# Altium schematic sheet 0226_GPU_ GPIO 2 OF 2.SchDoc
size 848 x 558 mm
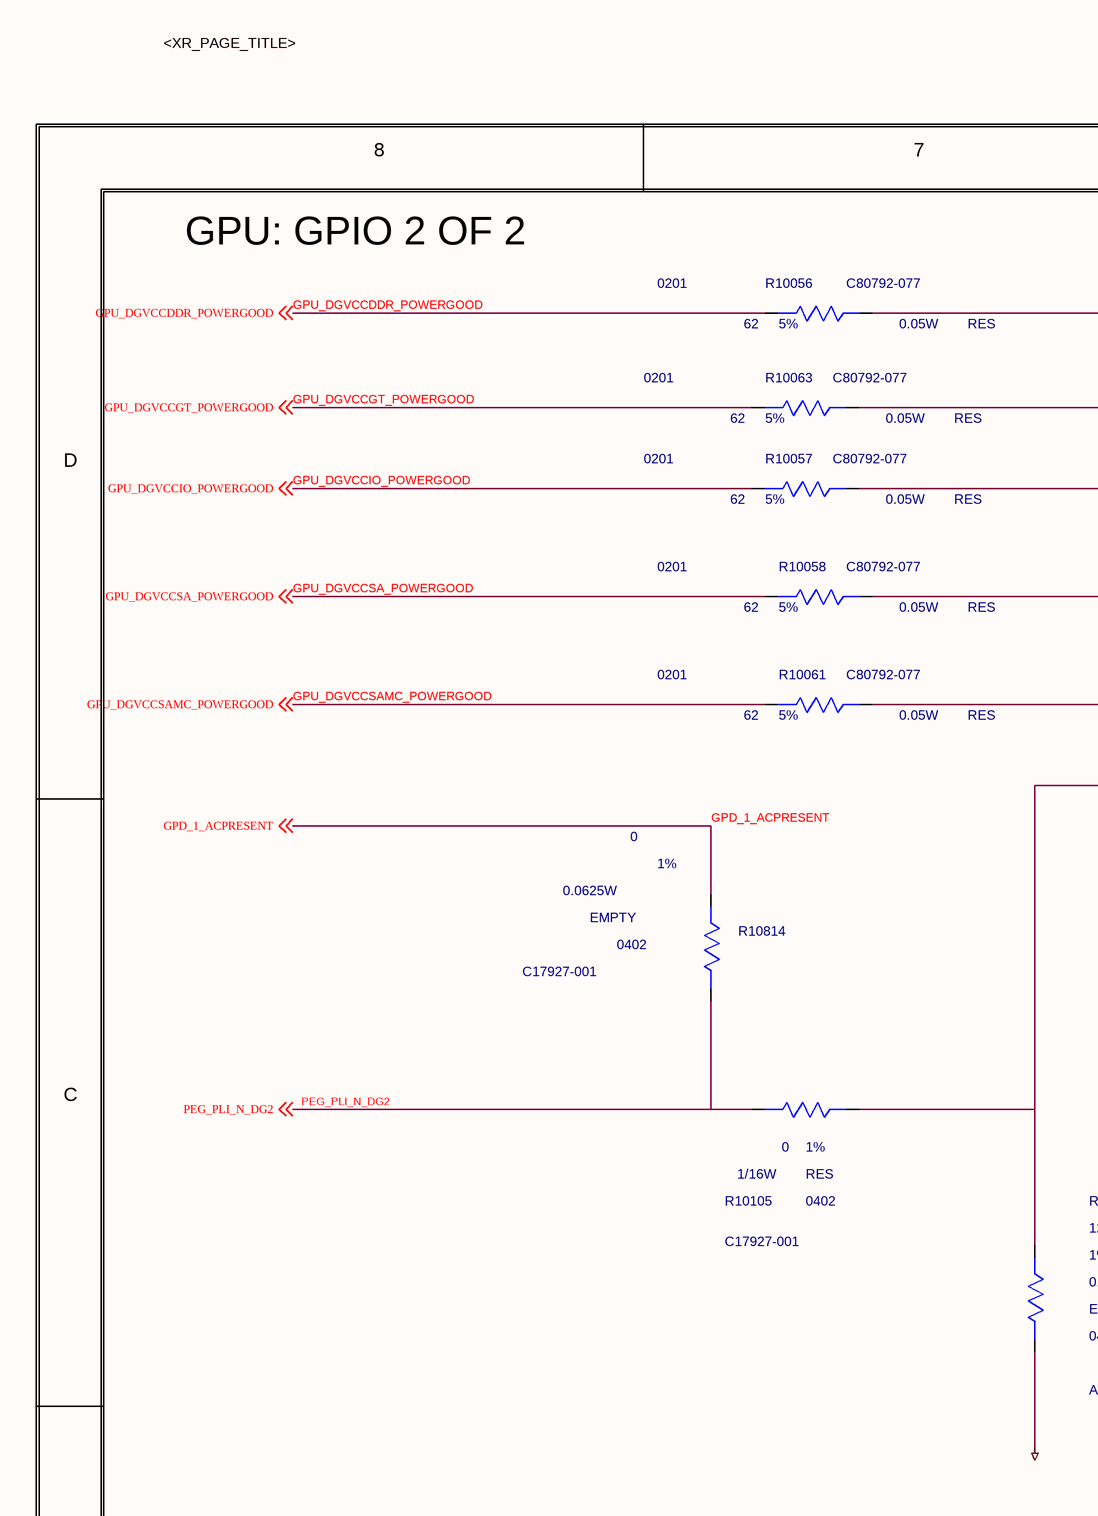
[diagram p0: 0226_GPU_ GPIO 2 OF 2.SchDoc, top left]
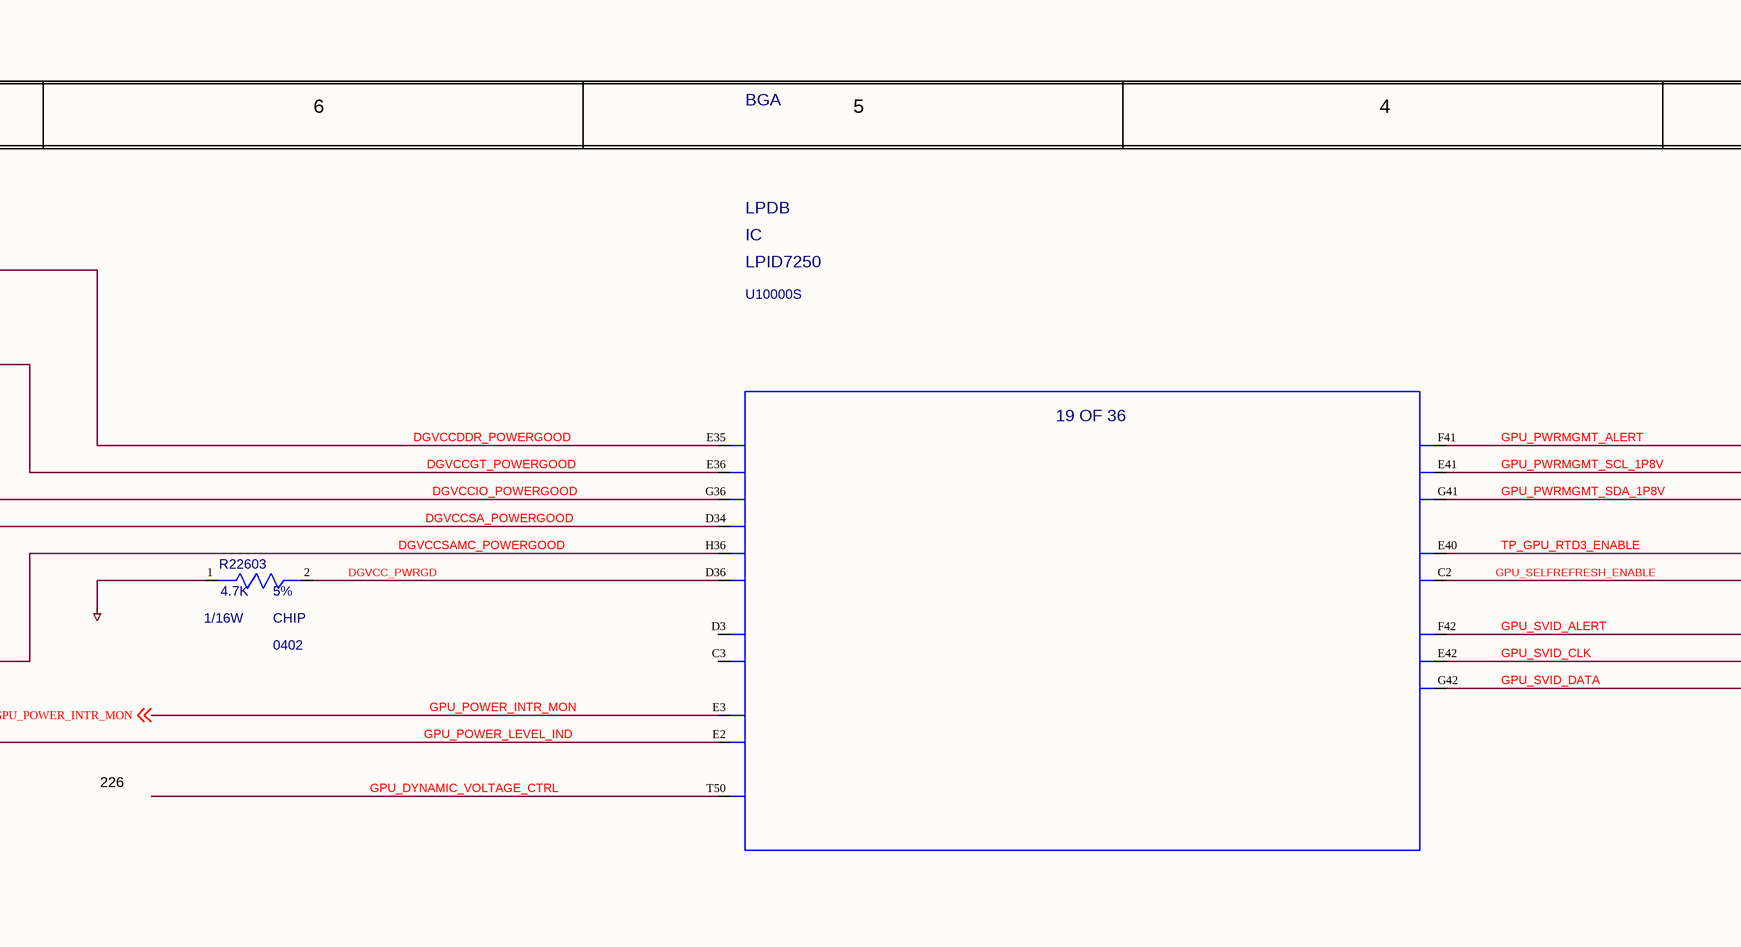
[diagram p1: 0226_GPU_ GPIO 2 OF 2.SchDoc, top middle]
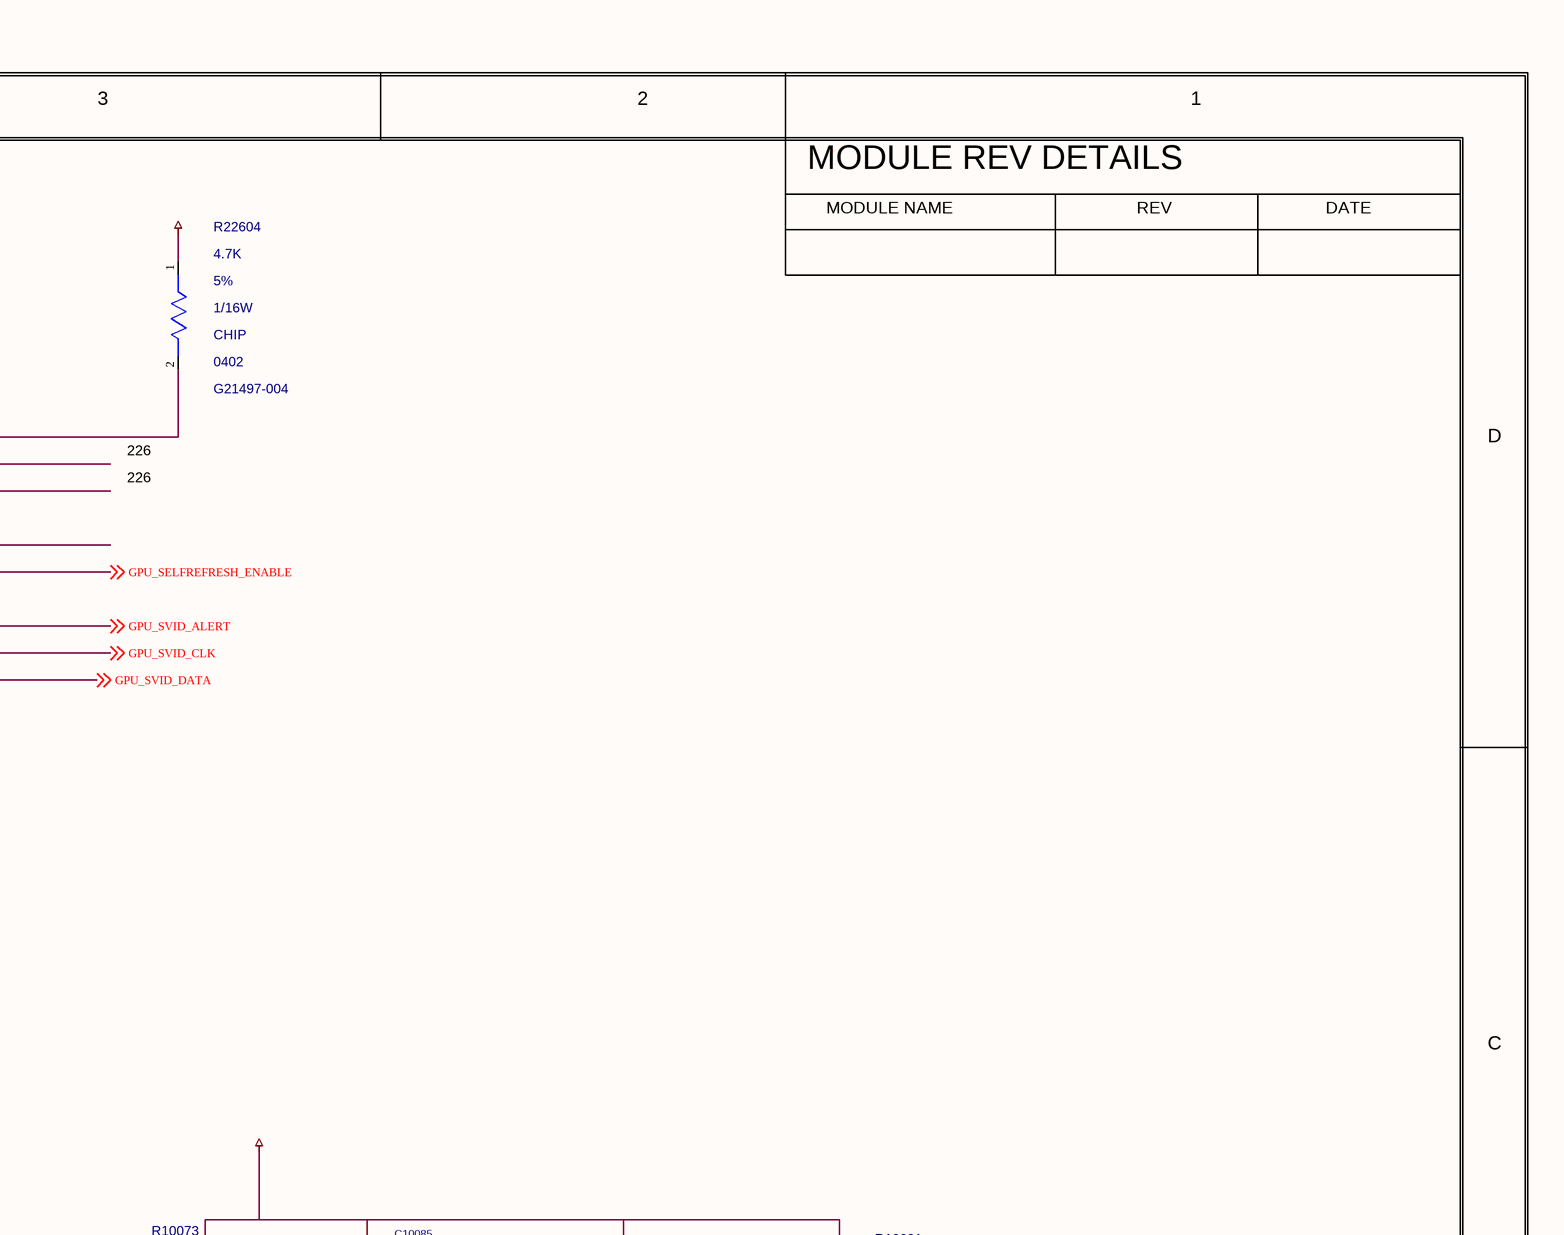
[diagram p2: 0226_GPU_ GPIO 2 OF 2.SchDoc, top right]
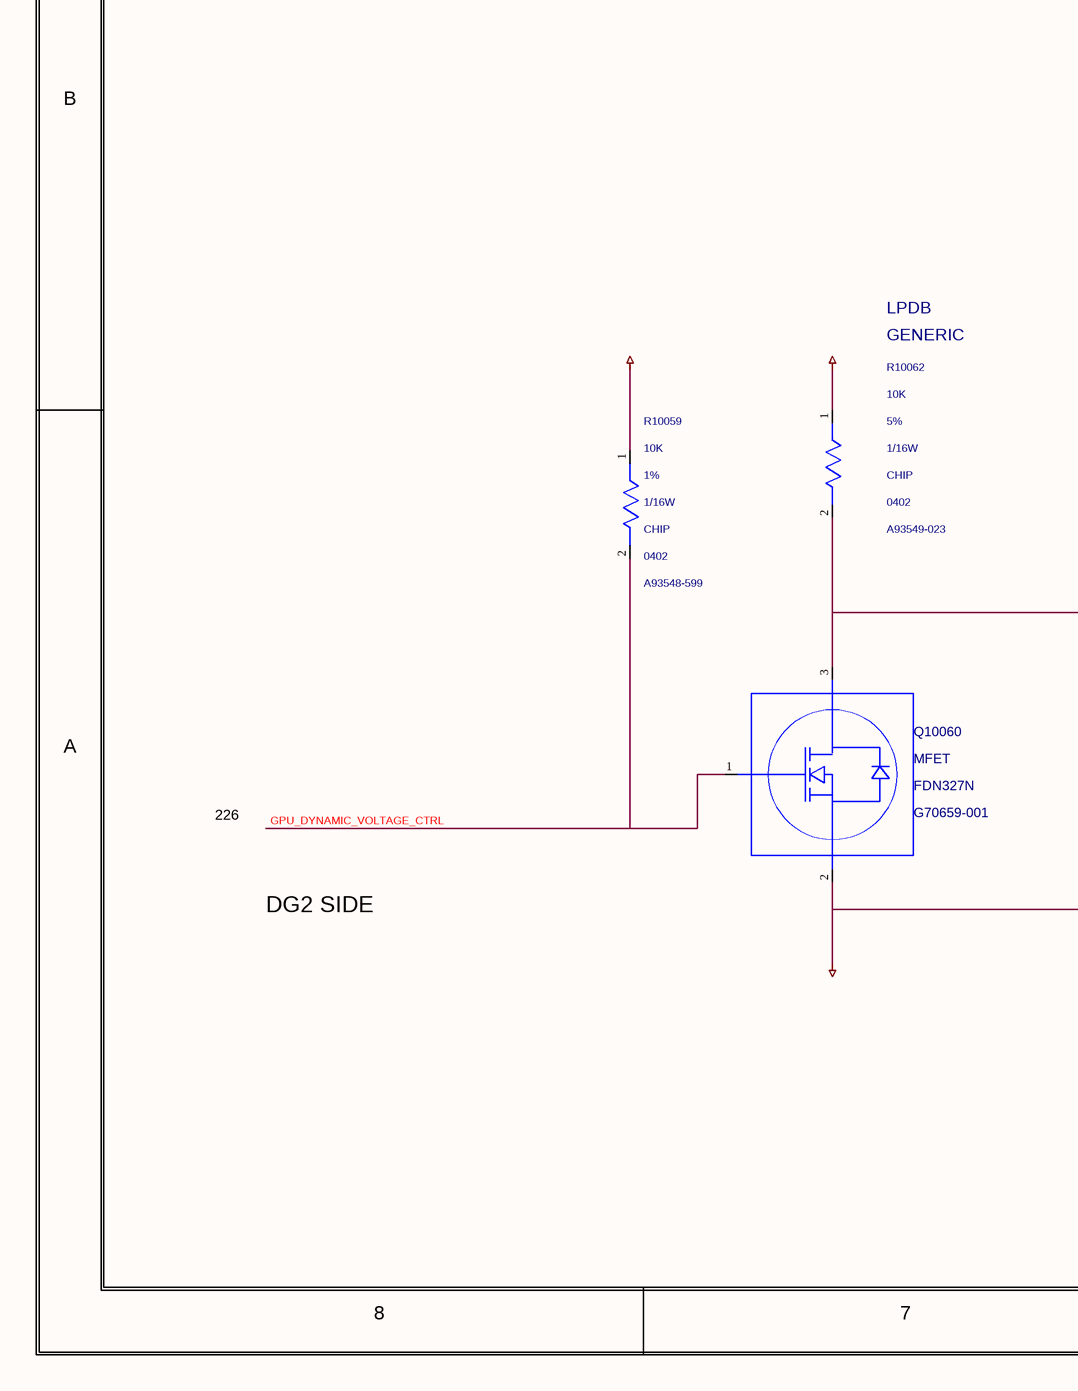
[diagram p3: 0226_GPU_ GPIO 2 OF 2.SchDoc, bottom left]
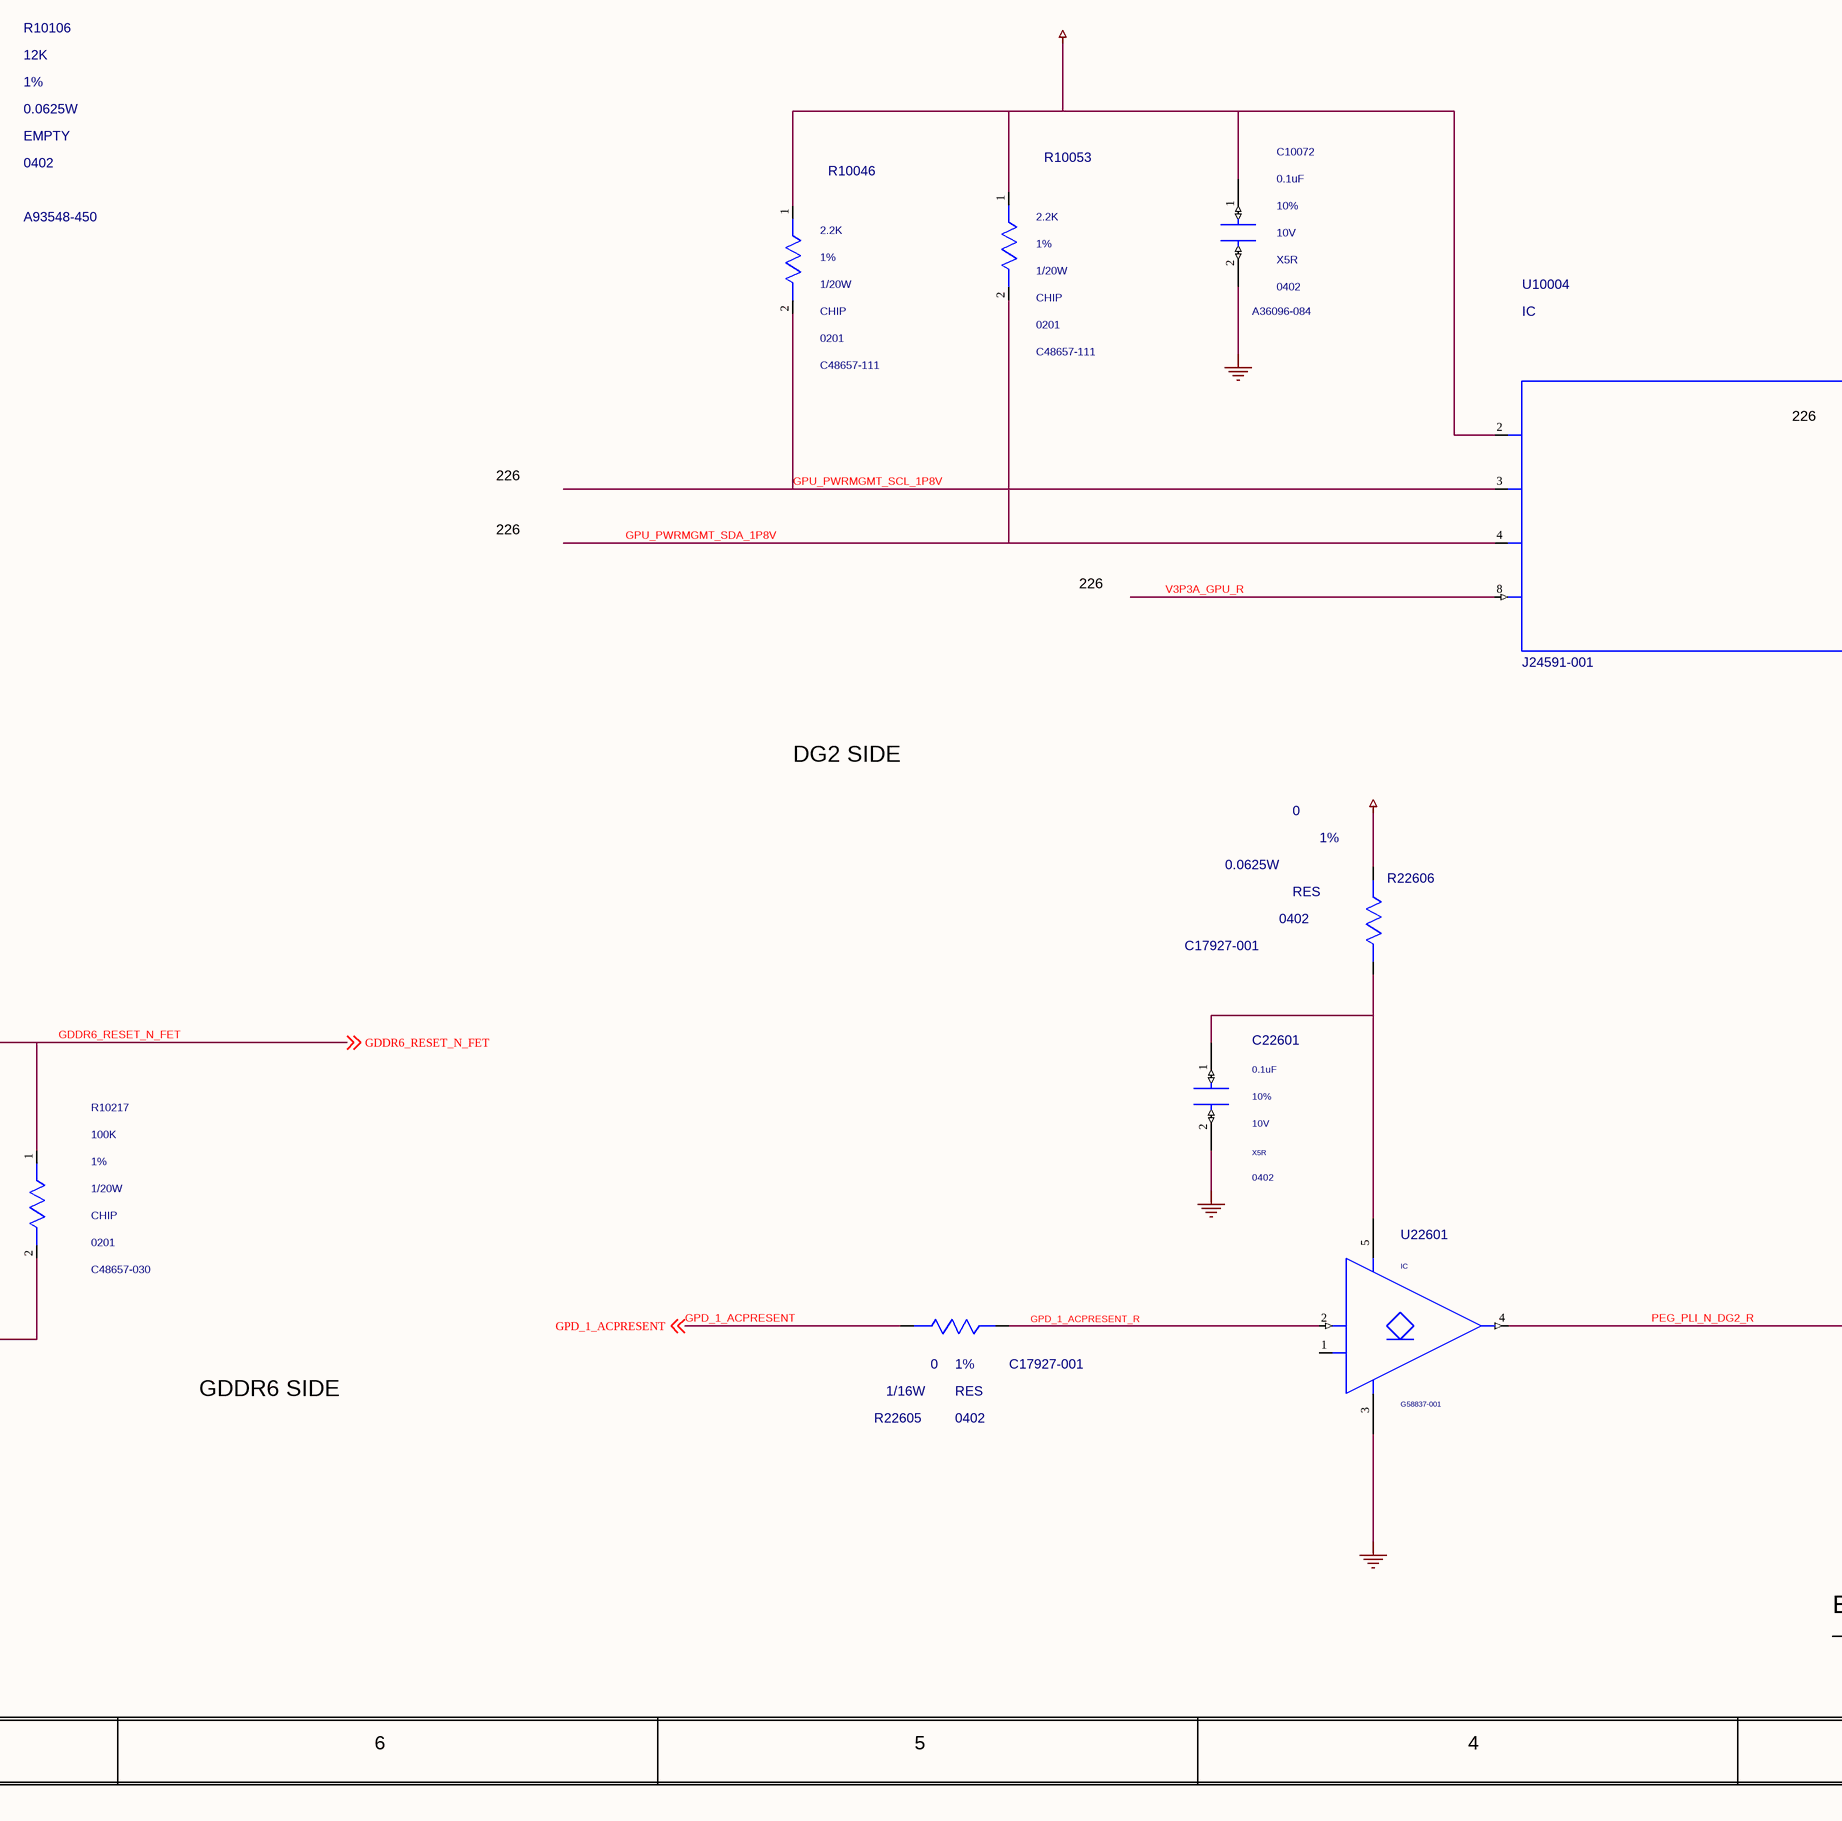
[diagram p4: 0226_GPU_ GPIO 2 OF 2.SchDoc, bottom middle]
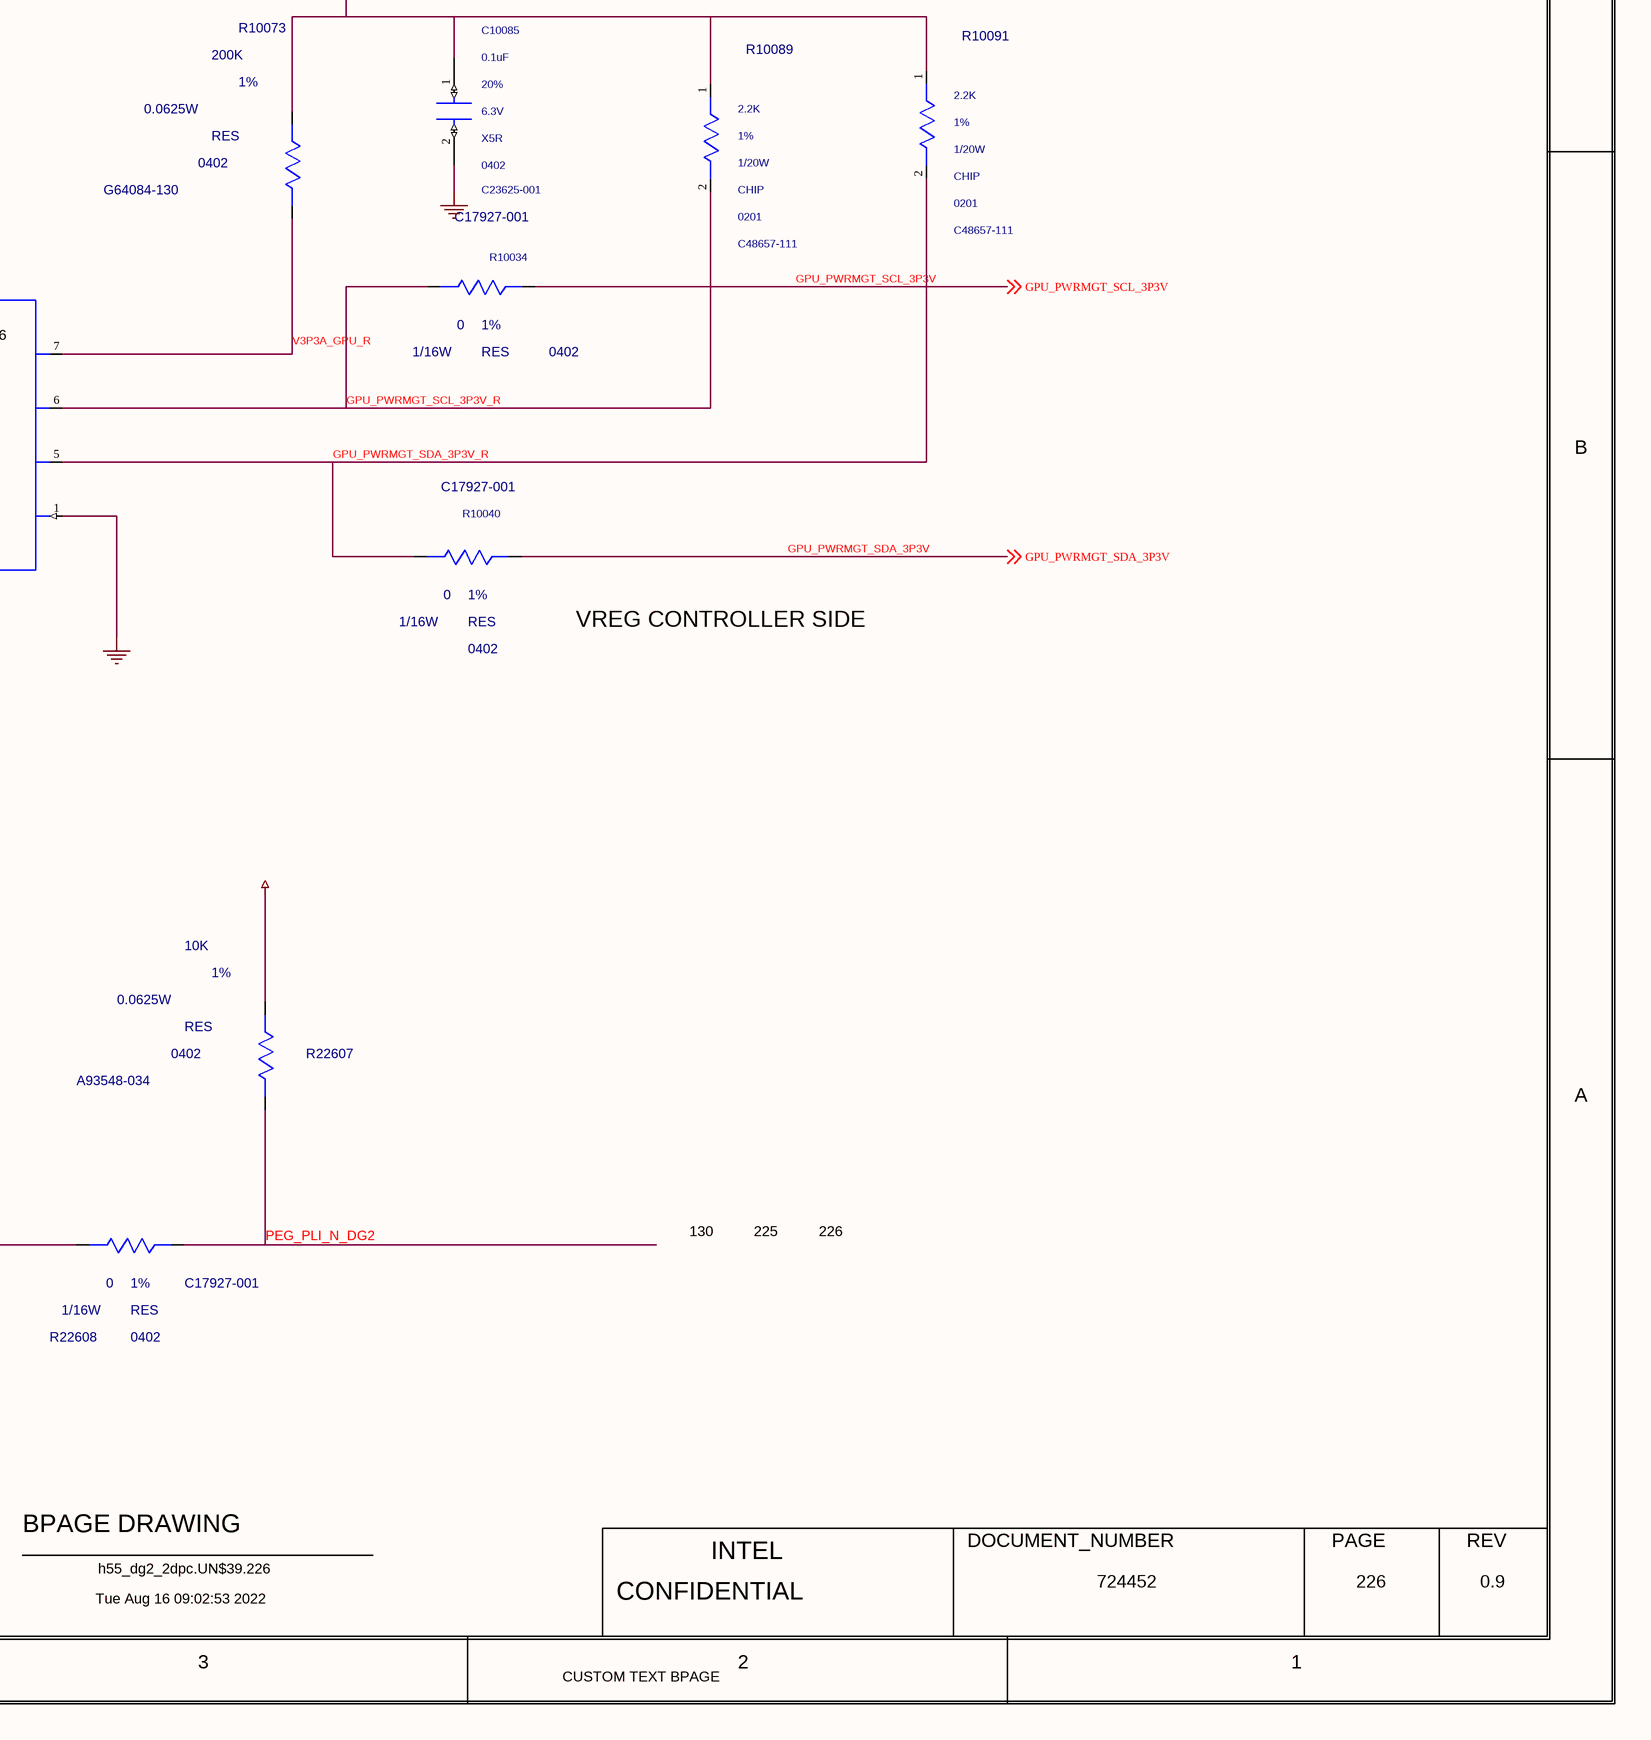
[diagram p5: 0226_GPU_ GPIO 2 OF 2.SchDoc, bottom right]

## Parts
C10072  0.1uF  MATERIAL: X5R  PACK_TYPE: 0402  PART_NUMBER: A36096-084  TOLERANCE: 10%  VOLTAGE: 10V  [SMC0402IA]
C10085  0.1uF  MATERIAL: X5R  PACK_TYPE: 0402  PART_NUMBER: C23625-001  TOLERANCE: 20%  VOLTAGE: 6.3V  [SMC0402IA]
C22601  0.1uF  MATERIAL: X5R  PACK_TYPE: 0402  TOLERANCE: 10%  VOLTAGE: 10V  [SMC0402IA]
Q10060  FDN327N  MATERIAL: MFET  PART_NUMBER: G70659-001  [CTK2_SOT23_1520X3040_950_MA]
R10034  0  MATERIAL: RES  PACK_TYPE: 0402  PART_NUMBER: C17927-001  TOLERANCE: 1%  WATTAGE: 1/16W  [TK0_SM0402_1100X550_MA]
R10040  0  MATERIAL: RES  PACK_TYPE: 0402  PART_NUMBER: C17927-001  TOLERANCE: 1%  WATTAGE: 1/16W  [TK0_SM0402_1100X550_MA]
R10046  2.2K  MATERIAL: CHIP  PACK_TYPE: 0201  PART_NUMBER: C48657-111  TOLERANCE: 1%  WATTAGE: 1/20W  [SMR0201IA]
R10053  2.2K  MATERIAL: CHIP  PACK_TYPE: 0201  PART_NUMBER: C48657-111  TOLERANCE: 1%  WATTAGE: 1/20W  [SMR0201IA]
R10056  62  MATERIAL: RES  PACK_TYPE: 0201  PART_NUMBER: C80792-077  TOLERANCE: 5%  WATTAGE: 0.05W  [TK2_SM0201_630X330_MA]
R10057  62  MATERIAL: RES  PACK_TYPE: 0201  PART_NUMBER: C80792-077  TOLERANCE: 5%  WATTAGE: 0.05W  [TK2_SM0201_630X330_MA]
R10058  62  MATERIAL: RES  PACK_TYPE: 0201  PART_NUMBER: C80792-077  TOLERANCE: 5%  WATTAGE: 0.05W  [TK2_SM0201_630X330_MA]
R10059  10K  MATERIAL: CHIP  PACK_TYPE: 0402  PART_NUMBER: A93548-599  TOLERANCE: 1%  WATTAGE: 1/16W  [SMR0402IA]
R10061  62  MATERIAL: RES  PACK_TYPE: 0201  PART_NUMBER: C80792-077  TOLERANCE: 5%  WATTAGE: 0.05W  [TK2_SM0201_630X330_MA]
R10062  10K  MATERIAL: CHIP  PACK_TYPE: 0402  PART_NUMBER: A93549-023  TOLERANCE: 5%  WATTAGE: 1/16W  IP: GENERIC  FP_TECH: LPDB  [SMR0402IA]
R10063  62  MATERIAL: RES  PACK_TYPE: 0201  PART_NUMBER: C80792-077  TOLERANCE: 5%  WATTAGE: 0.05W  [TK2_SM0201_630X330_MA]
R10073  200K  MATERIAL: RES  PACK_TYPE: 0402  PART_NUMBER: G64084-130  TOLERANCE: 1%  WATTAGE: 0.0625W  [CTK0_SM0402_1100X550_MA]
R10089  2.2K  MATERIAL: CHIP  PACK_TYPE: 0201  PART_NUMBER: C48657-111  TOLERANCE: 1%  WATTAGE: 1/20W  [SMR0201IA]
R10091  2.2K  MATERIAL: CHIP  PACK_TYPE: 0201  PART_NUMBER: C48657-111  TOLERANCE: 1%  WATTAGE: 1/20W  [SMR0201IA]
R10105  0  MATERIAL: RES  PACK_TYPE: 0402  PART_NUMBER: C17927-001  TOLERANCE: 1%  WATTAGE: 1/16W  [TK0_SM0402_1100X550_MA]
R10106  12K  MATERIAL: EMPTY  PACK_TYPE: 0402  PART_NUMBER: A93548-450  TOLERANCE: 1%  WATTAGE: 0.0625W  [CTK2_SM0402_1050X550_MA]
R10217  100K  MATERIAL: CHIP  PACK_TYPE: 0201  PART_NUMBER: C48657-030  TOLERANCE: 1%  WATTAGE: 1/20W  [SMR0201MC]
R10814  0  MATERIAL: EMPTY  PACK_TYPE: 0402  PART_NUMBER: C17927-001  TOLERANCE: 1%  WATTAGE: 0.0625W  [CTK2_SM0402_1100X550_MA]
R22603  4.7K  MATERIAL: CHIP  PACK_TYPE: 0402  TOLERANCE: 5%  WATTAGE: 1/16W  [SMR0402IA]
R22604  4.7K  MATERIAL: CHIP  PACK_TYPE: 0402  PART_NUMBER: G21497-004  TOLERANCE: 5%  WATTAGE: 1/16W  [SMR0402IA]
R22605  0  MATERIAL: RES  PACK_TYPE: 0402  PART_NUMBER: C17927-001  TOLERANCE: 1%  WATTAGE: 1/16W  [TK0_SM0402_1100X550_MA]
R22606  0  MATERIAL: RES  PACK_TYPE: 0402  PART_NUMBER: C17927-001  TOLERANCE: 1%  WATTAGE: 0.0625W  [CTK0_SM0402_1100X550_MA]
R22607  10K  MATERIAL: RES  PACK_TYPE: 0402  PART_NUMBER: A93548-034  TOLERANCE: 1%  WATTAGE: 0.0625W  [CTK0_SM0402_1100X550_MA]
R22608  0  MATERIAL: RES  PACK_TYPE: 0402  PART_NUMBER: C17927-001  TOLERANCE: 1%  WATTAGE: 1/16W  [TK0_SM0402_1100X550_MA]
U10000  PART_NUMBER: LPID7250  PACK_TYPE: BGA  MATERIAL: IC  FP_TECH: LPDB  [CLPDB_BGA2660_DG2_SVC_512_LP7250_MA]  (hidden comment: DG2_IP_NB_SKU1_SKU2_SKU3_EXT)  (part S of 36)
U10004  MATERIAL: IC  PART_NUMBER: J24591-001  [CTK0_VSSOP8_2400X2100_500_MA]  (hidden comment: C_LSF0102)
U22601  MATERIAL: IC  PART_NUMBER: G58837-001  [TSSOP5_21X13_65MA]  (hidden comment: TTL07)

## Nets
+V1P8S_GPU: C10072.1(A) R10046.1(A) R10053.1(A) R10059.1(A) R22604.1(A) R22607.1(A) U10004.2(VREF_A)
+V3P3DSW: R22606.1(A)
+V3P3S_GPU: C10085.1(A) R10073.1(A) R10089.1(A) R10091.1(A)
+V5S_GPU: R10062.1(A)
GND: C10072.2(B) C10085.2(B) C22601.2(B) Q10060.2(S) R10106.2(B) R10217.2(B) R22603.1(A) U10004.1(GND) U22601.3(GND)
DGVCC_PWRGD: R22603.2(B) U10000.D36(DGVCC_POWERGOOD)
DGVCCDDR_POWERGOOD: R10056.2(B) U10000.E35(VCCDDR_PWRGD)
DGVCCGT_POWERGOOD: R10063.2(B) U10000.E36(VCCGT_PWRGD)
DGVCCIO_POWERGOOD: R10057.2(B) U10000.G36(VCCIO_PWRGD)
DGVCCSA_POWERGOOD: R10058.2(B) U10000.D34(VCCSA_PWRGD)
DGVCCSAMC_POWERGOOD: R10061.2(B) U10000.H36(VCCSAMC_PWRGD)
GDDR6_RESET_N_FET: Q10060.3(D) R10062.2(B) R10217.1(A) ; off-sheet GDDR6_RESET_N_FET
GPD_1_ACPRESENT: R10814.1(A) R22605.1(A) ; off-sheet GPD_1_ACPRESENT
GPD_1_ACPRESENT_R: R22605.2(B) U22601.2(A)
GPU_DGVCCDDR_POWERGOOD: R10056.1(A) ; off-sheet GPU_DGVCCDDR_POWERGOOD
GPU_DGVCCGT_POWERGOOD: R10063.1(A) ; off-sheet GPU_DGVCCGT_POWERGOOD
GPU_DGVCCIO_POWERGOOD: R10057.1(A) ; off-sheet GPU_DGVCCIO_POWERGOOD
GPU_DGVCCSA_POWERGOOD: R10058.1(A) ; off-sheet GPU_DGVCCSA_POWERGOOD
GPU_DGVCCSAMC_POWERGOOD: R10061.1(A) ; off-sheet GPU_DGVCCSAMC_POWERGOOD
GPU_DYNAMIC_VOLTAGE_CTRL: Q10060.1(G) R10059.2(B) U10000.T50(DYNAMIC_VOLTAGE_CTRL)
GPU_POWER_INTR_MON: U10000.E3(POWER_INTR_MON) ; off-sheet GPU_POWER_INTR_MON
GPU_POWER_LEVEL_IND: R10105.2(B) R10106.1(A) U10000.E2(POWER_LEVEL_IND)
GPU_PWRMGMT_ALERT: R22604.2(B) U10000.F41(PWRMGMT_ALERT)
GPU_PWRMGMT_SCL_1P8V: R10046.2(B) U10000.E41(PWRMGMT_CLK) U10004.3(A1)
GPU_PWRMGMT_SDA_1P8V: R10053.2(B) U10000.G41(PWRMGMT_DATA) U10004.4(A2)
GPU_PWRMGT_SCL_3P3V: R10034.2(B) ; off-sheet GPU_PWRMGT_SCL_3P3V
GPU_PWRMGT_SCL_3P3V_R: R10034.1(A) R10089.2(B) U10004.6(B1)
GPU_PWRMGT_SDA_3P3V: R10040.2(B) ; off-sheet GPU_PWRMGT_SDA_3P3V
GPU_PWRMGT_SDA_3P3V_R: R10040.1(A) R10091.2(B) U10004.5(B2)
GPU_SELFREFRESH_ENABLE: U10000.C2(MEM_SR_EN) ; off-sheet GPU_SELFREFRESH_ENABLE
GPU_SVID_ALERT: U10000.F42(VIDALERT#) ; off-sheet GPU_SVID_ALERT
GPU_SVID_CLK: U10000.E42(VIDSCK) ; off-sheet GPU_SVID_CLK
GPU_SVID_DATA: U10000.G42(VIDSOUT) ; off-sheet GPU_SVID_DATA
PEG_PLI_N_DG2: R10105.1(A) R10814.2(B) R22607.2(B) R22608.2(B) ; off-sheet PEG_PLI_N_DG2
PEG_PLI_N_DG2_R: R22608.1(A) U22601.4(Y)
TP_GPU_RTD3_ENABLE: U10000.E40(RTD3_EN)
UNNAMED_397_CAP_I134_A: C22601.1(A) R22606.2(B) U22601.5(VCC)
V3P3A_GPU_R: R10073.2(B) U10004.7(VREF_B) U10004.8(EN)

Not connected (* = marked no-connect by the designer): U10000 C3(PHASE_DISTR_0) D3(PHASE_DISTR_1); U22601 1(NC)

## Notes on the sheet
- <XR_PAGE_TITLE>
- 8
- 7
- 6
- 5
- 4
- 3
- 2
- 1
- GPU: GPIO 2 OF 2
- MODULE REV DETAILS
- MODULE NAME
- REV
- DATE
- D
- 226
- C
- (near U10004) 226
- B
- DG2 SIDE
- VREG CONTROLLER SIDE
- A
- 130
- 225
- GDDR6 SIDE
- BPAGE DRAWING
- INTEL
- DOCUMENT_NUMBER
- PAGE
- Tue Aug 16 09:02:53 2022
- h55_dg2_2dpc.UN$39.226
- CONFIDENTIAL
- 724452
- 0.9
- CUSTOM TEXT BPAGE
- (in symbol DG2_IP_NB_SKU1_SKU2_SKU3_EXT, part S) 19 OF 36

## Library data of the parts
C10072 = CAP: CDS_PHYS_PART_NAME: CAP_0402-A36096-084,X5R,0.1UF,10V,10%,LPDB,GENERIC; OriginalSymbolOrigin: (-50,25); XY: (-3925,2750); VER: 1; ROT: 0; PHYS_PAGE: 226; LOCATION: C10072; DRAWING: @RVP1_ADL_SB_ADP_S_DDR5_SODIMM_2DPC_LIB.H55_DG2_2DPC(SCH_1):PAGE397; CDS_LIB: discrete; PCB Footprint: SMC0402IA; CHIPS_PART_NAME: CAP; CDS_PART_NAME: CAP_0402-A36096-084,X5R,0.1UF,10V,10%,LPDB,GENERIC; CDS_LOCATION: C10072
C10085 = CAP: CDS_PHYS_PART_NAME: CAP_0402-C23625-001,X5R,0.1UF,6.3V,20%,LPDB,GENERIC; OriginalSymbolOrigin: (-50,25); XY: (-2025,2825); VER: 1; ROT: 0; PHYS_PAGE: 226; LOCATION: C10085; DRAWING: @RVP1_ADL_SB_ADP_S_DDR5_SODIMM_2DPC_LIB.H55_DG2_2DPC(SCH_1):PAGE397; CDS_LIB: discrete; PCB Footprint: SMC0402IA; CHIPS_PART_NAME: CAP; CDS_PART_NAME: CAP_0402-C23625-001,X5R,0.1UF,6.3V,20%,LPDB,GENERIC; CDS_LOCATION: C10085
C22601 = CAP: PART_NUMBER: A36096-043; CDS_PHYS_PART_NAME: CAP_0402-A36096-043,X5R,0.1UF,10V,10%,LPDB,GENERIC; OriginalSymbolOrigin: (-50,25); XY: (-3975,1150); VER: 1; ROT: 0; ROOM: ROOM_PROP_TEST_259; PHYS_PAGE: 226; LOCATION: C22601; IP: GENERIC; FP_TECH: LPDB; DRAWING: @RVP1_ADL_SB_ADP_S_DDR5_SODIMM_2DPC_LIB.H55_DG2_2DPC(SCH_1):PAGE397; CDS_LIB: discrete; PCB Footprint: SMC0402IA; CHIPS_PART_NAME: CAP; CDS_PART_NAME: CAP_0402-A36096-043,X5R,0.1UF,10V,10%,LPDB,GENERIC; CDS_LOCATION: C22601
Q10060 = C_MOSFET_N#1: CDS_PHYS_PART_NAME: C_MOSFET_N_SOT23-G70659-001,MFET,FDN327N,TK2,GENERIC; CDS_LMAN_SYM_OUTLINE: -150,150,150,-150; FP_TECH: TK2; IP: GENERIC; PACK_TYPE: SOT23; ROOM: NONE; OriginalSymbolOrigin: (-175,175); XY: (-6650,950); VER: 1; ROT: 0; PHYS_PAGE: 226; LOCATION: Q10060; DRAWING: @RVP1_ADL_SB_ADP_S_DDR5_SODIMM_2DPC_LIB.H55_DG2_2DPC(SCH_1):PAGE397; CDS_LIB: local; VARIANT: ?; PCB Footprint: CTK2_SOT23_1520X3040_950_MA; SEC_TYPE: SOT23; CHIPS_PART_NAME: C_MOSFET_N; CDS_PART_NAME: C_MOSFET_N_SOT23-G70659-001,MFET,FDN327N,TK2,GENERIC; CDS_LOCATION: Q10060
R10034 = RES_2#1: CHIPS_PART_NAME: RES_2; CDS_PHYS_PART_NAME: RES_2_0402-C17927-001,RES,0,1%,1/16W,TK0,GENERIC; BOM_USE: STUFF; CDS_LMAN_SYM_OUTLINE: -50,50,50,-50; FP_TECH: TK0; IP: GENERIC; ROOM: NONE; OriginalSymbolOrigin: (-75,25); XY: (-1975,2500); VER: 1; PHYS_PAGE: 226; LOCATION: R10034; DRAWING: @RVP1_ADL_SB_ADP_S_DDR5_SODIMM_2DPC_LIB.H55_DG2_2DPC(SCH_1):PAGE397; CDS_LIB: discrete_2; VARIANT: ?; PCB Footprint: TK0_SM0402_1100X550_MA; ROT: 0; CDS_PART_NAME: RES_2_0402-C17927-001,RES,0,1%,1/16W,TK0,GENERIC; CDS_LOCATION: R10034
R10040 = RES_2#1: CHIPS_PART_NAME: RES_2; CDS_PHYS_PART_NAME: RES_2_0402-C17927-001,RES,0,1%,1/16W,TK0,GENERIC; BOM_USE: STUFF; CDS_LMAN_SYM_OUTLINE: -50,50,50,-50; FP_TECH: TK0; IP: GENERIC; ROOM: NONE; OriginalSymbolOrigin: (-75,25); XY: (-2000,2000); VER: 1; PHYS_PAGE: 226; LOCATION: R10040; DRAWING: @RVP1_ADL_SB_ADP_S_DDR5_SODIMM_2DPC_LIB.H55_DG2_2DPC(SCH_1):PAGE397; CDS_LIB: discrete_2; VARIANT: ?; PCB Footprint: TK0_SM0402_1100X550_MA; ROT: 0; CDS_PART_NAME: RES_2_0402-C17927-001,RES,0,1%,1/16W,TK0,GENERIC; CDS_LOCATION: R10040
R10046 = RES: CDS_PHYS_PART_NAME: RES_0201-C48657-111,CHIP,2.2K,1%,1/20W,LPDB,GENERIC; OriginalSymbolOrigin: (-25,75); XY: (-4750,2700); VER: 2; ROT: 0; PHYS_PAGE: 226; LOCATION: R10046; IP: GENERIC; FP_TECH: LPDB; DRAWING: @RVP1_ADL_SB_ADP_S_DDR5_SODIMM_2DPC_LIB.H55_DG2_2DPC(SCH_1):PAGE397; CDS_LIB: discrete; PCB Footprint: SMR0201IA; CHIPS_PART_NAME: RES; CDS_PART_NAME: RES_0201-C48657-111,CHIP,2.2K,1%,1/20W,LPDB,GENERIC; CDS_LOCATION: R10046
R10053 = RES: CDS_PHYS_PART_NAME: RES_0201-C48657-111,CHIP,2.2K,1%,1/20W,LPDB,GENERIC; OriginalSymbolOrigin: (-25,75); XY: (-4350,2725); VER: 2; ROT: 0; PHYS_PAGE: 226; LOCATION: R10053; IP: GENERIC; FP_TECH: LPDB; DRAWING: @RVP1_ADL_SB_ADP_S_DDR5_SODIMM_2DPC_LIB.H55_DG2_2DPC(SCH_1):PAGE397; CDS_LIB: discrete; PCB Footprint: SMR0201IA; CHIPS_PART_NAME: RES; CDS_PART_NAME: RES_0201-C48657-111,CHIP,2.2K,1%,1/20W,LPDB,GENERIC; CDS_LOCATION: R10053
R10056 = RES_2#1: CHIPS_PART_NAME: RES_2; CDS_PHYS_PART_NAME: RES_2_0201-C80792-077,RES,62,5%,0.05W,TK2,GENERIC; BOM_USE: STUFF; CDS_LMAN_SYM_OUTLINE: -50,50,50,-50; FP_TECH: TK2; IP: GENERIC; ROOM: NONE; OriginalSymbolOrigin: (-75,25); XY: (-6675,4775); VER: 1; ROT: 0; PHYS_PAGE: 226; LOCATION: R10056; DRAWING: @RVP1_ADL_SB_ADP_S_DDR5_SODIMM_2DPC_LIB.H55_DG2_2DPC(SCH_1):PAGE397; CDS_LIB: discrete_2; VARIANT: ?; PCB Footprint: TK2_SM0201_630X330_MA; CDS_PART_NAME: RES_2_0201-C80792-077,RES,62,5%,0.05W,TK2,GENERIC; CDS_LOCATION: R10056
R10057 = RES_2#1: CHIPS_PART_NAME: RES_2; CDS_PHYS_PART_NAME: RES_2_0201-C80792-077,RES,62,5%,0.05W,TK2,GENERIC; BOM_USE: STUFF; CDS_LMAN_SYM_OUTLINE: -50,50,50,-50; FP_TECH: TK2; IP: GENERIC; ROOM: NONE; OriginalSymbolOrigin: (-75,25); XY: (-6700,4450); VER: 1; ROT: 0; PHYS_PAGE: 226; LOCATION: R10057; DRAWING: @RVP1_ADL_SB_ADP_S_DDR5_SODIMM_2DPC_LIB.H55_DG2_2DPC(SCH_1):PAGE397; CDS_LIB: discrete_2; VARIANT: ?; PCB Footprint: TK2_SM0201_630X330_MA; CDS_PART_NAME: RES_2_0201-C80792-077,RES,62,5%,0.05W,TK2,GENERIC; CDS_LOCATION: R10057
R10058 = RES_2#1: CHIPS_PART_NAME: RES_2; CDS_PHYS_PART_NAME: RES_2_0201-C80792-077,RES,62,5%,0.05W,TK2,GENERIC; BOM_USE: STUFF; CDS_LMAN_SYM_OUTLINE: -50,50,50,-50; FP_TECH: TK2; IP: GENERIC; ROOM: NONE; OriginalSymbolOrigin: (-75,25); XY: (-6675,4250); VER: 1; ROT: 0; PHYS_PAGE: 226; LOCATION: R10058; DRAWING: @RVP1_ADL_SB_ADP_S_DDR5_SODIMM_2DPC_LIB.H55_DG2_2DPC(SCH_1):PAGE397; CDS_LIB: discrete_2; VARIANT: ?; PCB Footprint: TK2_SM0201_630X330_MA; CDS_PART_NAME: RES_2_0201-C80792-077,RES,62,5%,0.05W,TK2,GENERIC; CDS_LOCATION: R10058
R10059 = RES: CDS_PHYS_PART_NAME: RES_0402-A93548-599,CHIP,10K,1%,1/16W,LPDB,GENERIC; OriginalSymbolOrigin: (-25,75); XY: (-7025,1450); VER: 2; ROT: 0; PHYS_PAGE: 226; LOCATION: R10059; FP_TECH: LPDB; DRAWING: @RVP1_ADL_SB_ADP_S_DDR5_SODIMM_2DPC_LIB.H55_DG2_2DPC(SCH_1):PAGE397; CDS_LIB: discrete; PCB Footprint: SMR0402IA; CHIPS_PART_NAME: RES; CDS_PART_NAME: RES_0402-A93548-599,CHIP,10K,1%,1/16W,LPDB,GENERIC; CDS_LOCATION: R10059
R10061 = RES_2#1: CHIPS_PART_NAME: RES_2; CDS_PHYS_PART_NAME: RES_2_0201-C80792-077,RES,62,5%,0.05W,TK2,GENERIC; BOM_USE: STUFF; CDS_LMAN_SYM_OUTLINE: -50,50,50,-50; FP_TECH: TK2; IP: GENERIC; ROOM: NONE; OriginalSymbolOrigin: (-75,25); XY: (-6675,4050); VER: 1; ROT: 0; PHYS_PAGE: 226; LOCATION: R10061; DRAWING: @RVP1_ADL_SB_ADP_S_DDR5_SODIMM_2DPC_LIB.H55_DG2_2DPC(SCH_1):PAGE397; CDS_LIB: discrete_2; VARIANT: ?; PCB Footprint: TK2_SM0201_630X330_MA; CDS_PART_NAME: RES_2_0201-C80792-077,RES,62,5%,0.05W,TK2,GENERIC; CDS_LOCATION: R10061
R10062 = RES: CDS_PHYS_PART_NAME: RES_0402-A93549-023,CHIP,10K,5%,1/16W,LPDB,GENERIC; OriginalSymbolOrigin: (-25,75); XY: (-6650,1525); VER: 2; ROT: 0; PHYS_PAGE: 226; LOCATION: R10062; DRAWING: @RVP1_ADL_SB_ADP_S_DDR5_SODIMM_2DPC_LIB.H55_DG2_2DPC(SCH_1):PAGE397; CDS_LIB: discrete; PCB Footprint: SMR0402IA; CHIPS_PART_NAME: RES; CDS_PART_NAME: RES_0402-A93549-023,CHIP,10K,5%,1/16W,LPDB,GENERIC; CDS_LOCATION: R10062
R10063 = RES_2#1: CHIPS_PART_NAME: RES_2; CDS_PHYS_PART_NAME: RES_2_0201-C80792-077,RES,62,5%,0.05W,TK2,GENERIC; BOM_USE: STUFF; CDS_LMAN_SYM_OUTLINE: -50,50,50,-50; FP_TECH: TK2; IP: GENERIC; ROOM: NONE; OriginalSymbolOrigin: (-75,25); XY: (-6700,4600); VER: 1; ROT: 0; PHYS_PAGE: 226; LOCATION: R10063; DRAWING: @RVP1_ADL_SB_ADP_S_DDR5_SODIMM_2DPC_LIB.H55_DG2_2DPC(SCH_1):PAGE397; CDS_LIB: discrete_2; VARIANT: ?; PCB Footprint: TK2_SM0201_630X330_MA; CDS_PART_NAME: RES_2_0201-C80792-077,RES,62,5%,0.05W,TK2,GENERIC; CDS_LOCATION: R10063
R10073 = C_RES: CDS_PHYS_PART_NAME: C_RES_0402-G64084-130,RES,200K,1%,0.0625W,TK0,GENERIC; CDS_LMAN_SYM_OUTLINE: -50,50,50,-50; FP_TECH: TK0; IP: GENERIC; ROOM: NONE; OriginalSymbolOrigin: (-25,75); XY: (-2325,2725); VER: 2; ROT: 0; PHYS_PAGE: 226; LOCATION: R10073; DRAWING: @RVP1_ADL_SB_ADP_S_DDR5_SODIMM_2DPC_LIB.H55_DG2_2DPC(SCH_1):PAGE397; CDS_LIB: c_discrete; VARIANT: ?; PCB Footprint: CTK0_SM0402_1100X550_MA; CHIPS_PART_NAME: C_RES; CDS_PART_NAME: C_RES_0402-G64084-130,RES,200K,1%,0.0625W,TK0,GENERIC; CDS_LOCATION: R10073
R10089 = RES: CDS_PHYS_PART_NAME: RES_0201-C48657-111,CHIP,2.2K,1%,1/20W,LPDB,GENERIC; OriginalSymbolOrigin: (-25,75); XY: (-1550,2775); VER: 2; ROT: 0; PHYS_PAGE: 226; LOCATION: R10089; IP: GENERIC; FP_TECH: LPDB; DRAWING: @RVP1_ADL_SB_ADP_S_DDR5_SODIMM_2DPC_LIB.H55_DG2_2DPC(SCH_1):PAGE397; CDS_LIB: discrete; PCB Footprint: SMR0201IA; CHIPS_PART_NAME: RES; CDS_PART_NAME: RES_0201-C48657-111,CHIP,2.2K,1%,1/20W,LPDB,GENERIC; CDS_LOCATION: R10089
R10091 = RES: CDS_PHYS_PART_NAME: RES_0201-C48657-111,CHIP,2.2K,1%,1/20W,LPDB,GENERIC; OriginalSymbolOrigin: (-25,75); XY: (-1150,2800); VER: 2; ROT: 0; PHYS_PAGE: 226; LOCATION: R10091; IP: GENERIC; FP_TECH: LPDB; DRAWING: @RVP1_ADL_SB_ADP_S_DDR5_SODIMM_2DPC_LIB.H55_DG2_2DPC(SCH_1):PAGE397; CDS_LIB: discrete; PCB Footprint: SMR0201IA; CHIPS_PART_NAME: RES; CDS_PART_NAME: RES_0201-C48657-111,CHIP,2.2K,1%,1/20W,LPDB,GENERIC; CDS_LOCATION: R10091
R10105 = RES_2#1: CHIPS_PART_NAME: RES_2; CDS_PHYS_PART_NAME: RES_2_0402-C17927-001,RES,0,1%,1/16W,TK0,GENERIC; BOM_USE: STUFF; CDS_LMAN_SYM_OUTLINE: -50,50,50,-50; FP_TECH: TK0; IP: GENERIC; ROOM: NONE; OriginalSymbolOrigin: (-75,25); XY: (-6700,3300); VER: 1; PHYS_PAGE: 226; LOCATION: R10105; DRAWING: @RVP1_ADL_SB_ADP_S_DDR5_SODIMM_2DPC_LIB.H55_DG2_2DPC(SCH_1):PAGE397; CDS_LIB: discrete_2; VARIANT: ?; PCB Footprint: TK0_SM0402_1100X550_MA; ROT: 0; CDS_PART_NAME: RES_2_0402-C17927-001,RES,0,1%,1/16W,TK0,GENERIC; CDS_LOCATION: R10105
R10106 = C_RES: CDS_PHYS_PART_NAME: C_RES_0402-A93548-450,EMPTY,12K,1%,0.0625W,TK2,GENERIC; CDS_LMAN_SYM_OUTLINE: -50,50,50,-50; FP_TECH: TK2; IP: GENERIC; ROOM: NONE; OriginalSymbolOrigin: (-25,75); XY: (-6275,2950); VER: 2; ROT: 0; PHYS_PAGE: 226; LOCATION: R10106; DRAWING: @RVP1_ADL_SB_ADP_S_DDR5_SODIMM_2DPC_LIB.H55_DG2_2DPC(SCH_1):PAGE397; CDS_LIB: c_discrete; VARIANT: ?; PCB Footprint: CTK2_SM0402_1050X550_MA; CHIPS_PART_NAME: C_RES; CDS_PART_NAME: C_RES_0402-A93548-450,EMPTY,12K,1%,0.0625W,TK2,GENERIC; CDS_LOCATION: R10106
R10217 = RES: CDS_PHYS_PART_NAME: RES_0201-C48657-030,CHIP,100K,1%,1/20W,LPDB,GENERIC; OriginalSymbolOrigin: (-25,75); XY: (-6150,950); VER: 2; ROT: 0; PHYS_PAGE: 226; LOCATION: R10217; FP_TECH: LPDB; DRAWING: @RVP1_ADL_SB_ADP_S_DDR5_SODIMM_2DPC_LIB.H55_DG2_2DPC(SCH_1):PAGE397; CDS_LIB: discrete; PCB Footprint: SMR0201MC; CHIPS_PART_NAME: RES; CDS_PART_NAME: RES_0201-C48657-030,CHIP,100K,1%,1/20W,LPDB,GENERIC; CDS_LOCATION: R10217
R10814 = C_RES: CDS_PHYS_PART_NAME: C_RES_0402-C17927-001,EMPTY,0,1%,0.0625W,TK2,GENERIC; CDS_LMAN_SYM_OUTLINE: -50,50,50,-50; FP_TECH: TK2; IP: GENERIC; ROOM: NONE; OriginalSymbolOrigin: (-25,75); XY: (-6875,3600); VER: 2; PHYS_PAGE: 226; LOCATION: R10814; DRAWING: @RVP1_ADL_SB_ADP_S_DDR5_SODIMM_2DPC_LIB.H55_DG2_2DPC(SCH_1):PAGE397; CDS_LIB: c_discrete; VARIANT: ?; PCB Footprint: CTK2_SM0402_1100X550_MA; ROT: 0; CHIPS_PART_NAME: C_RES; CDS_PART_NAME: C_RES_0402-C17927-001,EMPTY,0,1%,0.0625W,TK2,GENERIC; CDS_LOCATION: R10814
R22603 = RES#1: PART_NUMBER: G21497-004; CHIPS_PART_NAME: RES; CDS_PHYS_PART_NAME: RES_0402-G21497-004,CHIP,4.7K,5%,1/16W,LPDB,GENERIC; OriginalSymbolOrigin: (-75,25); XY: (-5600,4200); VER: 1; ROT: 0; PHYS_PAGE: 226; LOCATION: R22603; IP: GENERIC; FP_TECH: LPDB; DRAWING: @RVP1_ADL_SB_ADP_S_DDR5_SODIMM_2DPC_LIB.H55_DG2_2DPC(SCH_1):PAGE397; CDS_LIB: discrete; PCB Footprint: SMR0402IA; CDS_PART_NAME: RES_0402-G21497-004,CHIP,4.7K,5%,1/16W,LPDB,GENERIC; CDS_LOCATION: R22603
R22604 = RES: CDS_PHYS_PART_NAME: RES_0402-G21497-004,CHIP,4.7K,5%,1/16W,LPDB,GENERIC; OriginalSymbolOrigin: (-25,75); XY: (-2375,4675); VER: 2; ROT: 0; PHYS_PAGE: 226; LOCATION: R22604; IP: GENERIC; FP_TECH: LPDB; DRAWING: @RVP1_ADL_SB_ADP_S_DDR5_SODIMM_2DPC_LIB.H55_DG2_2DPC(SCH_1):PAGE397; CDS_LIB: discrete; PCB Footprint: SMR0402IA; CHIPS_PART_NAME: RES; CDS_PART_NAME: RES_0402-G21497-004,CHIP,4.7K,5%,1/16W,LPDB,GENERIC; CDS_LOCATION: R22604
R22605 = RES_2#1: CHIPS_PART_NAME: RES_2; CDS_PHYS_PART_NAME: RES_2_0402-C17927-001,RES,0,1%,1/16W,TK0,GENERIC; BOM_USE: STUFF; CDS_LMAN_SYM_OUTLINE: -50,50,50,-50; FP_TECH: TK0; IP: GENERIC; ROOM: NONE; OriginalSymbolOrigin: (-75,25); XY: (-4450,725); VER: 1; PHYS_PAGE: 226; LOCATION: R22605; DRAWING: @RVP1_ADL_SB_ADP_S_DDR5_SODIMM_2DPC_LIB.H55_DG2_2DPC(SCH_1):PAGE397; CDS_LIB: discrete_2; VARIANT: ?; PCB Footprint: TK0_SM0402_1100X550_MA; ROT: 0; CDS_PART_NAME: RES_2_0402-C17927-001,RES,0,1%,1/16W,TK0,GENERIC; CDS_LOCATION: R22605
R22606 = C_RES: CDS_PHYS_PART_NAME: C_RES_0402-C17927-001,RES,0,1%,0.0625W,TK0,GENERIC; CDS_LMAN_SYM_OUTLINE: -50,50,50,-50; FP_TECH: TK0; IP: GENERIC; ROOM: NONE; OriginalSymbolOrigin: (-25,75); XY: (-3675,1475); VER: 2; PHYS_PAGE: 226; LOCATION: R22606; DRAWING: @RVP1_ADL_SB_ADP_S_DDR5_SODIMM_2DPC_LIB.H55_DG2_2DPC(SCH_1):PAGE397; CDS_LIB: c_discrete; VARIANT: ?; PCB Footprint: CTK0_SM0402_1100X550_MA; ROT: 0; CHIPS_PART_NAME: C_RES; CDS_PART_NAME: C_RES_0402-C17927-001,RES,0,1%,0.0625W,TK0,GENERIC; CDS_LOCATION: R22606
R22607 = C_RES: CDS_PHYS_PART_NAME: C_RES_0402-A93548-034,RES,10K,1%,0.0625W,TK0,GENERIC; CDS_LMAN_SYM_OUTLINE: -50,50,50,-50; FP_TECH: TK0; IP: GENERIC; ROOM: NONE; OriginalSymbolOrigin: (-25,75); XY: (-2375,1075); VER: 2; ROT: 0; PHYS_PAGE: 226; LOCATION: R22607; DRAWING: @RVP1_ADL_SB_ADP_S_DDR5_SODIMM_2DPC_LIB.H55_DG2_2DPC(SCH_1):PAGE397; CDS_LIB: c_discrete; VARIANT: ?; PCB Footprint: CTK0_SM0402_1100X550_MA; CHIPS_PART_NAME: C_RES; CDS_PART_NAME: C_RES_0402-A93548-034,RES,10K,1%,0.0625W,TK0,GENERIC; CDS_LOCATION: R22607
R22608 = RES_2#1: CHIPS_PART_NAME: RES_2; CDS_PHYS_PART_NAME: RES_2_0402-C17927-001,RES,0,1%,1/16W,TK0,GENERIC; BOM_USE: STUFF; CDS_LMAN_SYM_OUTLINE: -50,50,50,-50; FP_TECH: TK0; IP: GENERIC; ROOM: NONE; OriginalSymbolOrigin: (-75,25); XY: (-2625,725); VER: 1; PHYS_PAGE: 226; LOCATION: R22608; DRAWING: @RVP1_ADL_SB_ADP_S_DDR5_SODIMM_2DPC_LIB.H55_DG2_2DPC(SCH_1):PAGE397; CDS_LIB: discrete_2; VARIANT: ?; PCB Footprint: TK0_SM0402_1100X550_MA; ROT: 0; CDS_PART_NAME: RES_2_0402-C17927-001,RES,0,1%,1/16W,TK0,GENERIC; CDS_LOCATION: R22608
U10000 = DG2_IP_NB_SKU1_SKU2_SKU3_EXT: MANUF: INTEL CORP; CDS_PHYS_PART_NAME: DG2_IP_NB_SKU1_SKU2_SKU3_EXT_BGA-LPID7250,IC,DG2_IP_NB_SKU1_SKUA; CDS_LMAN_SYM_OUTLINE: -300,850,300,-800; OriginalSymbolOrigin: (-325,850); CaptureCellPackProp: DG2_IP_NB_SKU1_SKU2_SKU3_EXTS; XY: (-4100,4100); VER: 19; ROT: 0; PHYS_PAGE: 226; MFG_PN: NONE; LOCATION: U10000; DRAWING: @RVP1_ADL_SB_ADP_S_DDR5_SODIMM_2DPC_LIB.H55_DG2_2DPC(SCH_1):PAGE397; CDS_LIB: rvp1_adl_sb_adp_s_ddr5_sodimm_2dpc_lib; BMAP_REV: 1.0; PCB Footprint: CLPDB_BGA2660_DG2_SVC_512_LP7250_MA; SEC_TYPE: BGA; CHIPS_PART_NAME: DG2_IP_NB_SKU1_SKU2_SKU3_EXT; CDS_PART_NAME: DG2_IP_NB_SKU1_SKU2_SKU3_EXT_BGA-LPID7250,IC,DG2_IP_NB_SKU1_SKUA; CDS_LOCATION: U10000
U10004 = C_LSF0102: CDS_PHYS_PART_NAME: C_LSF0102_VSSOP-J24591-001,IC,LSF0102DCUR,TK0,GENERIC; CDS_LMAN_SYM_OUTLINE: -300,250,300,-250; FP_TECH: TK0; IP: GENERIC; PACK_TYPE: VSSOP; ROOM: NONE; OriginalSymbolOrigin: (-325,250); XY: (-3100,2225); VER: 1; ROT: 0; PHYS_PAGE: 226; LOCATION: U10004; DRAWING: @RVP1_ADL_SB_ADP_S_DDR5_SODIMM_2DPC_LIB.H55_DG2_2DPC(SCH_1):PAGE397; CDS_LIB: local; VARIANT: ?; PCB Footprint: CTK0_VSSOP8_2400X2100_500_MA; SEC_TYPE: VSSOP; CHIPS_PART_NAME: C_LSF0102; CDS_PART_NAME: C_LSF0102_VSSOP-J24591-001,IC,LSF0102DCUR,TK0,GENERIC; CDS_LOCATION: U10004
U22601 = TTL07: CDS_PHYS_PART_NAME: TTL07_SM-G58837-001,IC,74AUP1G07GW,LPDB,GENERIC; CDS_LMAN_SYM_OUTLINE: -100,150,150,-150; PACK_TYPE: SM; OriginalSymbolOrigin: (-125,125); XY: (-3625,725); VER: 1; ROT: 0; PHYS_PAGE: 226; LOCATION: U22601; IP: GENERIC; FP_TECH: LPDB; DRAWING: @RVP1_ADL_SB_ADP_S_DDR5_SODIMM_2DPC_LIB.H55_DG2_2DPC(SCH_1):PAGE397; CDS_LIB: ttl; PCB Footprint: TSSOP5_21X13_65MA; SEC_TYPE: SM; CHIPS_PART_NAME: TTL07; CDS_PART_NAME: TTL07_SM-G58837-001,IC,74AUP1G07GW,LPDB,GENERIC; CDS_LOCATION: U22601; ASI_MODEL: G58837-001